# EAGLE design MoonInMyRoom (EAGLE 5.10)
EAGLEUP: TQFP32
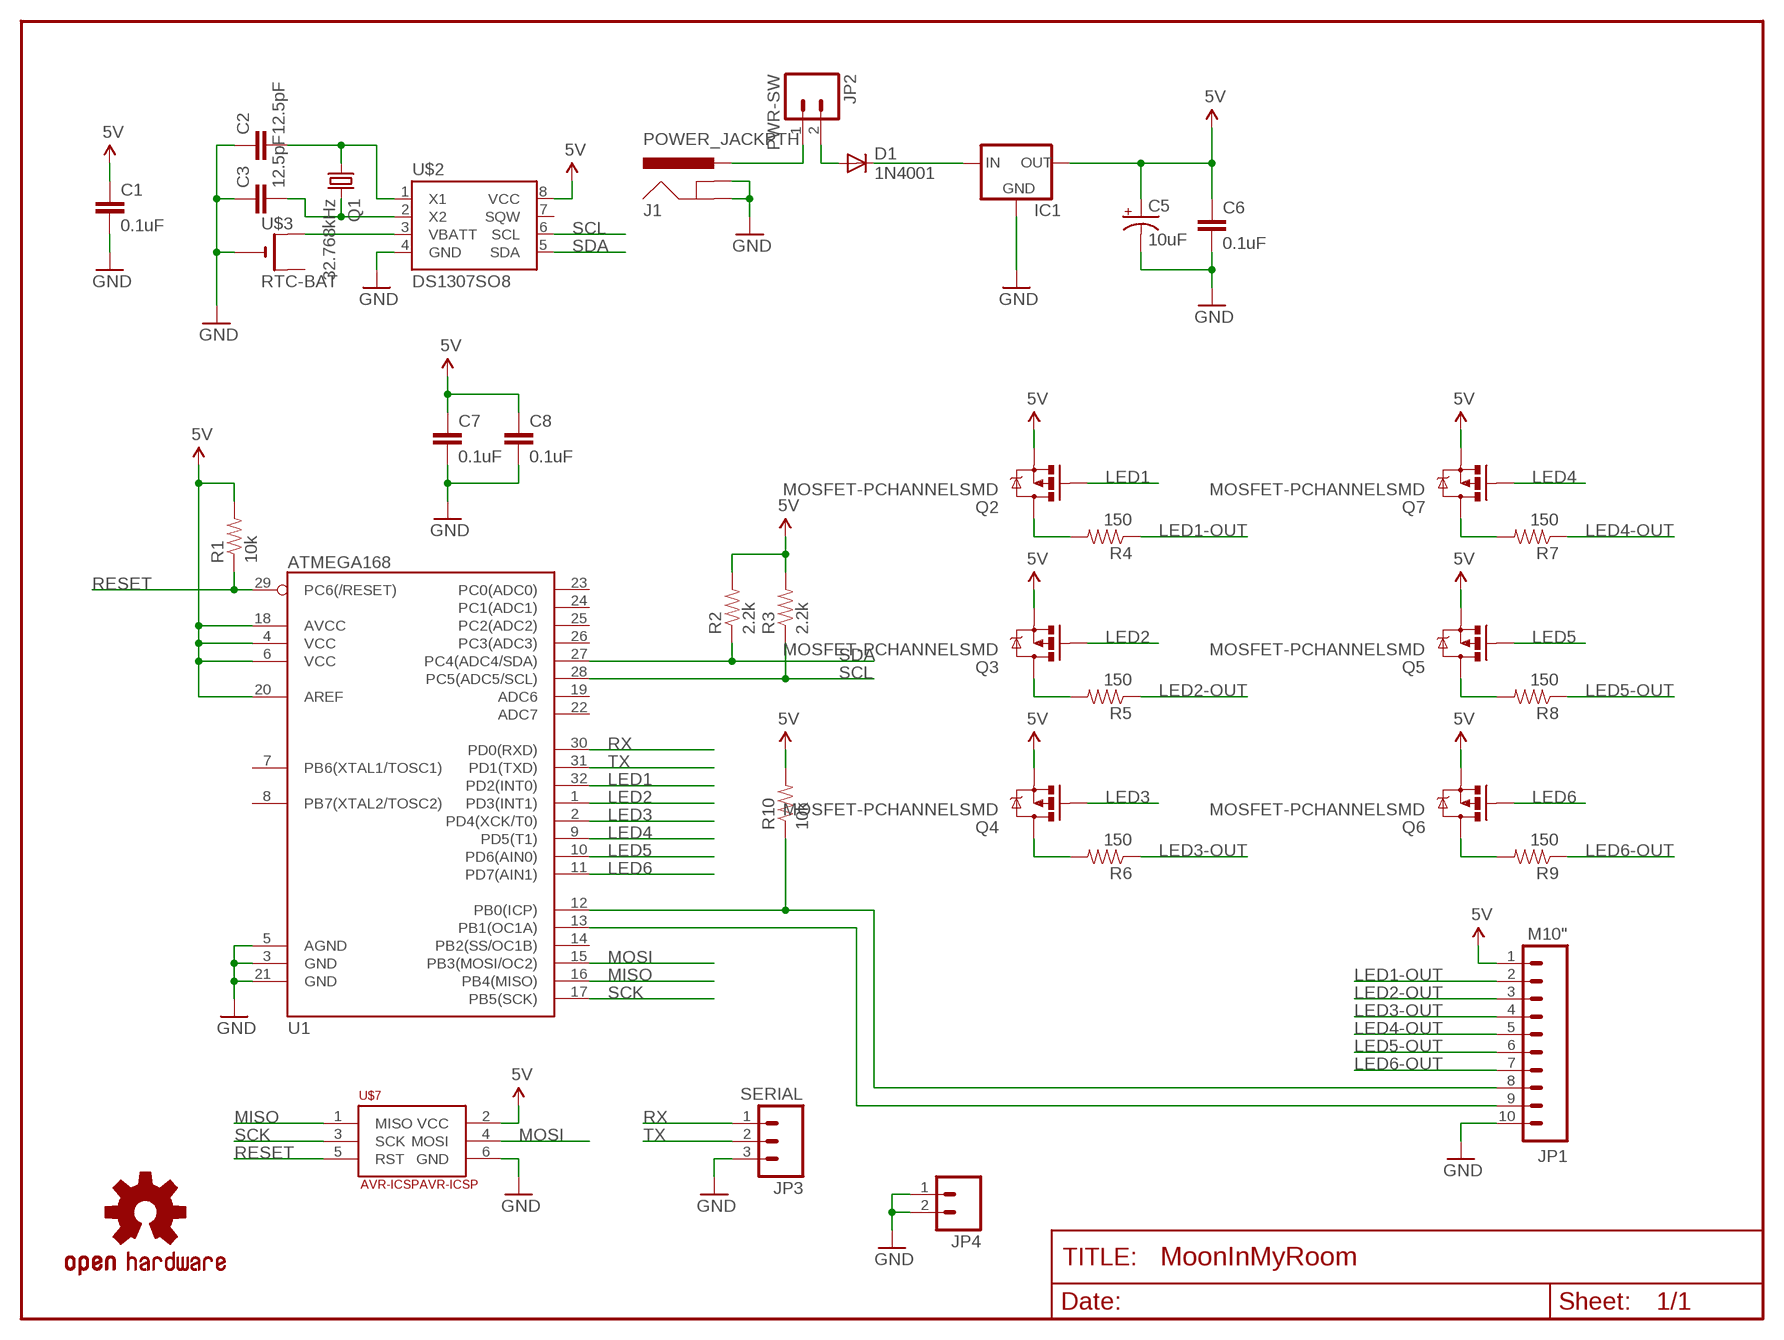
[diagram p0: schematic, sheet 1]

## Parts
C1  0.1uF  CAP0805  [0805]
C2  12.5pF  CAP0805  [0805]
C3  12.5pF  CAP0805  [0805]
C5  10uF  CAP_POL1206  [EIA3216]
C6  0.1uF  CAP0805  [0805]
C7  0.1uF  CAP0805  [0805]
C8  0.1uF  CAP0805  [0805]
D1  1N4001  DIODESMA  [SMA-DIODE]
IC1  V_REG_78XXSINK  [TO220-IGO]
J1  POWER_JACKPTH  [POWER_JACK_PTH]
JP1  M10"  [1X10]
JP2  PWR-SW  M02PTH  [1X02]
JP3  SERIAL  M03PTH  [1X03]
JP4  M02PTH  [1X02]
Q1  32.768kHz  CRYSTALSOJ-4-5.5MM  [SOJ-4-5.5MM]
Q2  MOSFET-PCHANNELSMD  [SOT23-3]
Q3  MOSFET-PCHANNELSMD  [SOT23-3]
Q4  MOSFET-PCHANNELSMD  [SOT23-3]
Q5  MOSFET-PCHANNELSMD  [SOT23-3]
Q6  MOSFET-PCHANNELSMD  [SOT23-3]
Q7  MOSFET-PCHANNELSMD  [SOT23-3]
R1  10k  RESISTOR0805-RES  [0805]
R2  2.2k  RESISTOR0805-RES  [0805]
R3  2.2k  RESISTOR0805-RES  [0805]
R4  150  RESISTOR0805-RES  [0805]
R5  150  RESISTOR0805-RES  [0805]
R6  150  RESISTOR0805-RES  [0805]
R7  150  RESISTOR0805-RES  [0805]
R8  150  RESISTOR0805-RES  [0805]
R9  150  RESISTOR0805-RES  [0805]
R10  10k  RESISTOR0805-RES  [0805]
U1  ATMEGA168  [TQFP32-08]
U$2  DS1307SO8  [SO08]
U$3  RTC-BAT  CR1220SMT  [CR1220-SMD]
U$7  AVR-ICSPAVR-ICSP  [AVR-ICSP]
U$20  OSHW-LOGOM  [OSHW-LOGO-M]

## Nets
5V: C1.1 C5.A(+) C6.1 C7.1 C8.1 IC1.OUT JP1.1 Q2.2(S) Q3.2(S) Q4.2(S) Q5.2(S) Q6.2(S) Q7.2(S) R1.2 R2.2 R3.2 R10.2 U1.4(VCC) U1.6(VCC) U1.18(AVCC) U1.20(AREF) U$2.8(VCC) U$7.2(VCC)
GND: C1.2 C2.1 C3.1 C5.C(-) C6.2 C7.2 C8.2 IC1.GND J1.GND J1.GNDBREAK JP1.10 JP3.3 JP4.1 JP4.2 U1.3(GND) U1.5(AGND) U1.21(GND) U$2.4(GND) U$3.- U$7.6(GND)
LED1: Q2.1(G) U1.32(PD2(INT0))
LED1-OUT: JP1.2 R4.1
LED2: Q3.1(G) U1.1(PD3(INT1))
LED2-OUT: JP1.3 R5.1
LED3: Q4.1(G) U1.2(PD4(XCK/T0))
LED3-OUT: JP1.4 R6.1
LED4: Q7.1(G) U1.9(PD5(T1))
LED4-OUT: JP1.5 R7.1
LED5: Q5.1(G) U1.10(PD6(AIN0))
LED5-OUT: JP1.6 R8.1
LED6: Q6.1(G) U1.11(PD7(AIN1))
LED6-OUT: JP1.7 R9.1
MISO: U1.16(PB4(MISO)) U$7.1(MISO)
MOSI: U1.15(PB3(MOSI/OC2)) U$7.4(MOSI)
N$1: U$2.3(VBATT) U$3.+$1(+)
N$2: Q2.3(D) R4.2
N$3: C3.2 Q1.P4 U$2.2(X2)
N$4: C2.2 Q1.P1 U$2.1(X1)
N$5: JP1.8 R10.1 U1.12(PB0(ICP))
N$6: Q3.3(D) R5.2
N$7: Q4.3(D) R6.2
N$8: Q5.3(D) R8.2
N$9: Q6.3(D) R9.2
N$10: JP1.9 U1.13(PB1(OC1A))
N$11: J1.PWR JP2.1
N$12: D1.A JP2.2
N$13: D1.C IC1.IN
N$16: Q7.3(D) R7.2
RESET: R1.1 U1.29(PC6(/RESET)) U$7.5(RST)
RX: JP3.1 U1.30(PD0(RXD))
SCK: U1.17(PB5(SCK)) U$7.3(SCK)
SCL: R3.1 U1.28(PC5(ADC5/SCL)) U$2.6(SCL)
SDA: R2.1 U1.27(PC4(ADC4/SDA)) U$2.5(SDA)
TX: JP3.2 U1.31(PD1(TXD))
Unconnected: U1.7(PB6(XTAL1/TOSC1)) U1.8(PB7(XTAL2/TOSC2)) U1.14(PB2(SS/OC1B)) U1.19(ADC6) U1.22(ADC7) U1.23(PC0(ADC0)) U1.24(PC1(ADC1)) U1.25(PC2(ADC2)) U1.26(PC3(ADC3)) U$2.7(SQW) U$3.+$2(+1)

## Library data of the parts
C1-C3 C6-C8 = SparkFun:CAP: Capacitor Standard 0603 ceramic capacitor, and 0.1" leaded capacitor.
C5 = SparkFun:CAP_POL: Capacitor Polarized These are standard SMD and PTH capacitors. Normally 10uF, 47uF, and 100uF in electrolytic and tantalum varieties. Always verify the external diameter of the through hole cap, it varies with capacity, voltage, and manufacturer. The EIA devices should be standard.
D1 = SparkFun:DIODE: Diode These are standard reverse protection diodes and small signal diodes. SMA package can handle up to about 1A. SOD-323 can handle about 200mA. What the SOD-323 package when ordering, there are some mfgs out there that are 5-pin packages.
IC1 = SparkFun:V_REG_78XX: Voltage Regulator Standard 7805 5V regulator. IGO (Input Ground Output). Spark Fun Electronics SKU : COM-00107
J1 = SparkFun:POWER_JACK: Power Jack This is the standard 5.5mm barrel jack for power. The PTH is the most common, proven, reliable, footprint. All others are experimental. The Slot footprint only works if the mill layer is transmitted to the PCB fab house so be warned. Spark Fun Electronics SKU : PRT-00119. Mating wall wart : TOL-00298 (and others)
JP1 = SparkFun:M10: Header 10 Standard 10-pin 0.1" header. Use with straight break away headers (SKU : PRT-00116), right angle break away headers (PRT-00553), swiss pins (PRT-00743), machine pins (PRT-00117), and female headers (PRT-00115).
JP2 JP4 = SparkFun:M02: Header 2 Standard 2-pin 0.1" header. Use with straight break away headers (SKU : PRT-00116), right angle break away headers (PRT-00553), swiss pins (PRT-00743), machine pins (PRT-00117), and female headers (PRT-00115). Molex polarized connector foot print use with SKU : PRT-08233 with associated crimp pins and housings.
JP3 = SparkFun:M03: Header 3 Standard 3-pin 0.1" header. Use with straight break away headers (SKU : PRT-00116), right angle break away headers (PRT-00553), swiss pins (PRT-00743), machine pins (PRT-00117), and female headers (PRT-00115). Molex polarized connector foot print use with SKU : PRT-08232 with associated crimp pins and housings.
Q1 = FiveVolt:CRYSTAL
Q2-Q7 = SparkFun:MOSFET-PCHANNEL
R1-R10 = SparkFun:RESISTOR: Resistor Basic schematic elements and footprints for 0603, 1206, and PTH resistors.
U1 = SparkFun:ATMEGA168
U$2 = SparkFun:DS1307
U$3 = adafruit:CR1220: CR1216/CR1220/CR1225 12mm 3V lithium coin cell Great for battery packup. Both SMT and THM holders. Note the THM package has the ground pads on both sides of the PCB so that the masks are the same - this reduces the cost
U$7 = FiveVolt:AVR-ICSP; EAGLEUP: JP3Q
U$20 = SparkFun:OSHW-LOGO: Open Source Hardware Logo This logo indicates the piece of hardware it is found on incorporates a OSHW license and/or adheres to the definition of open source hardware found here: http://freedomdefined.org/OSHW

## Board
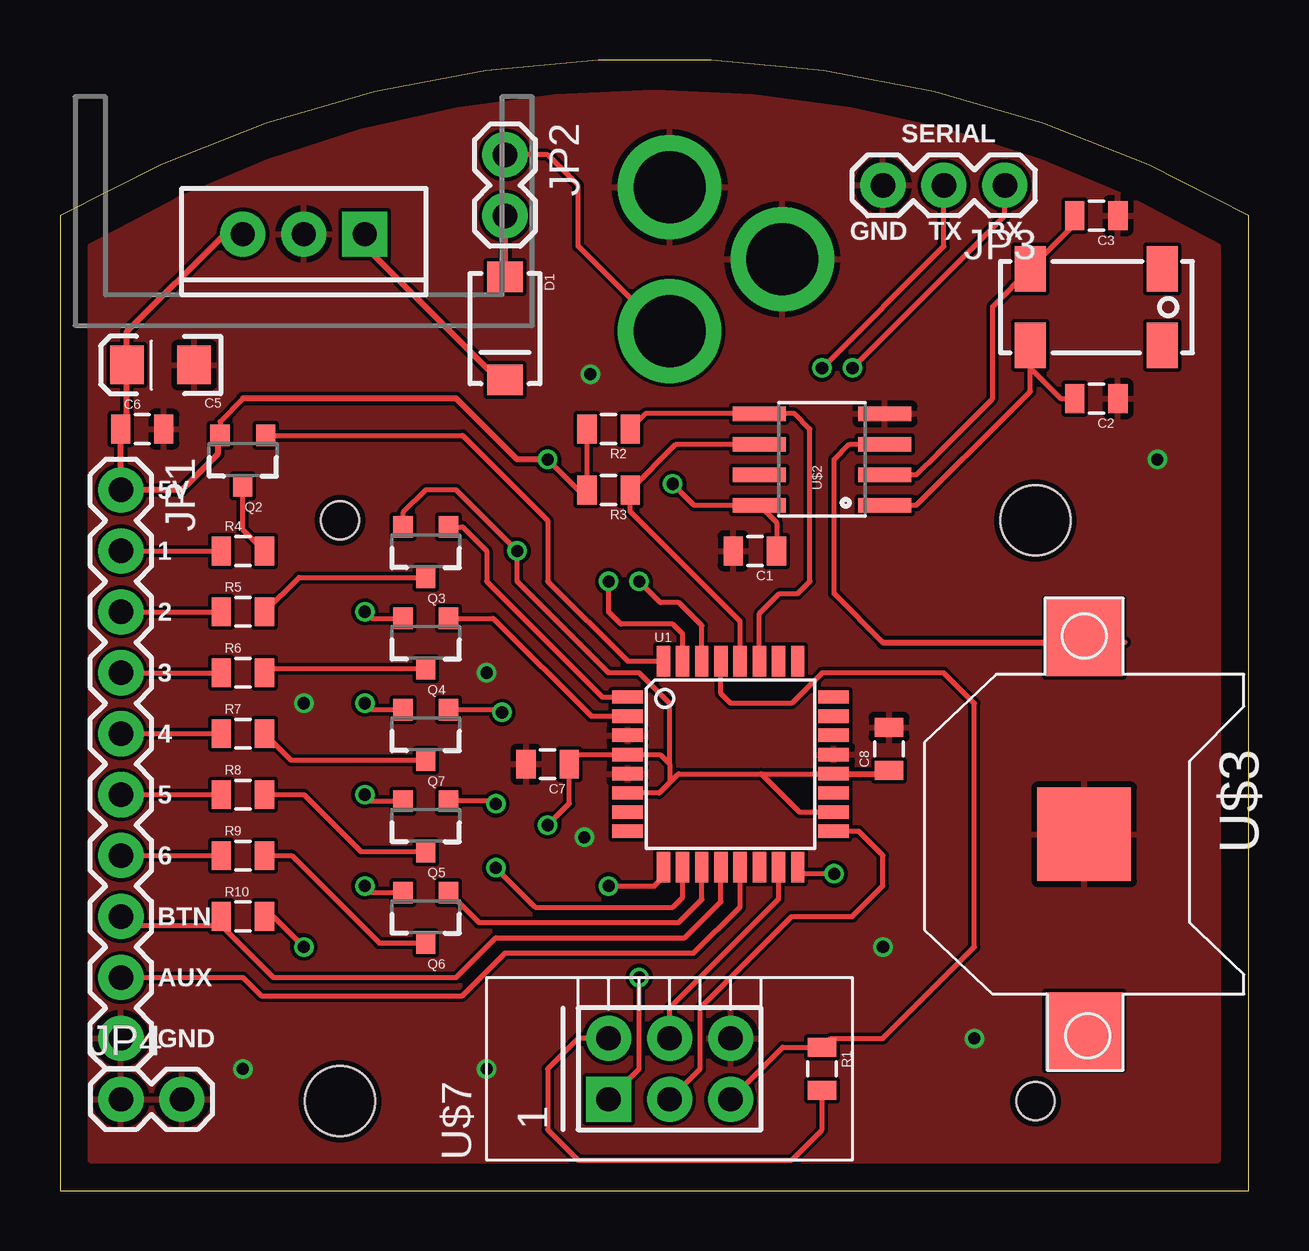
[diagram p1: board, top side]
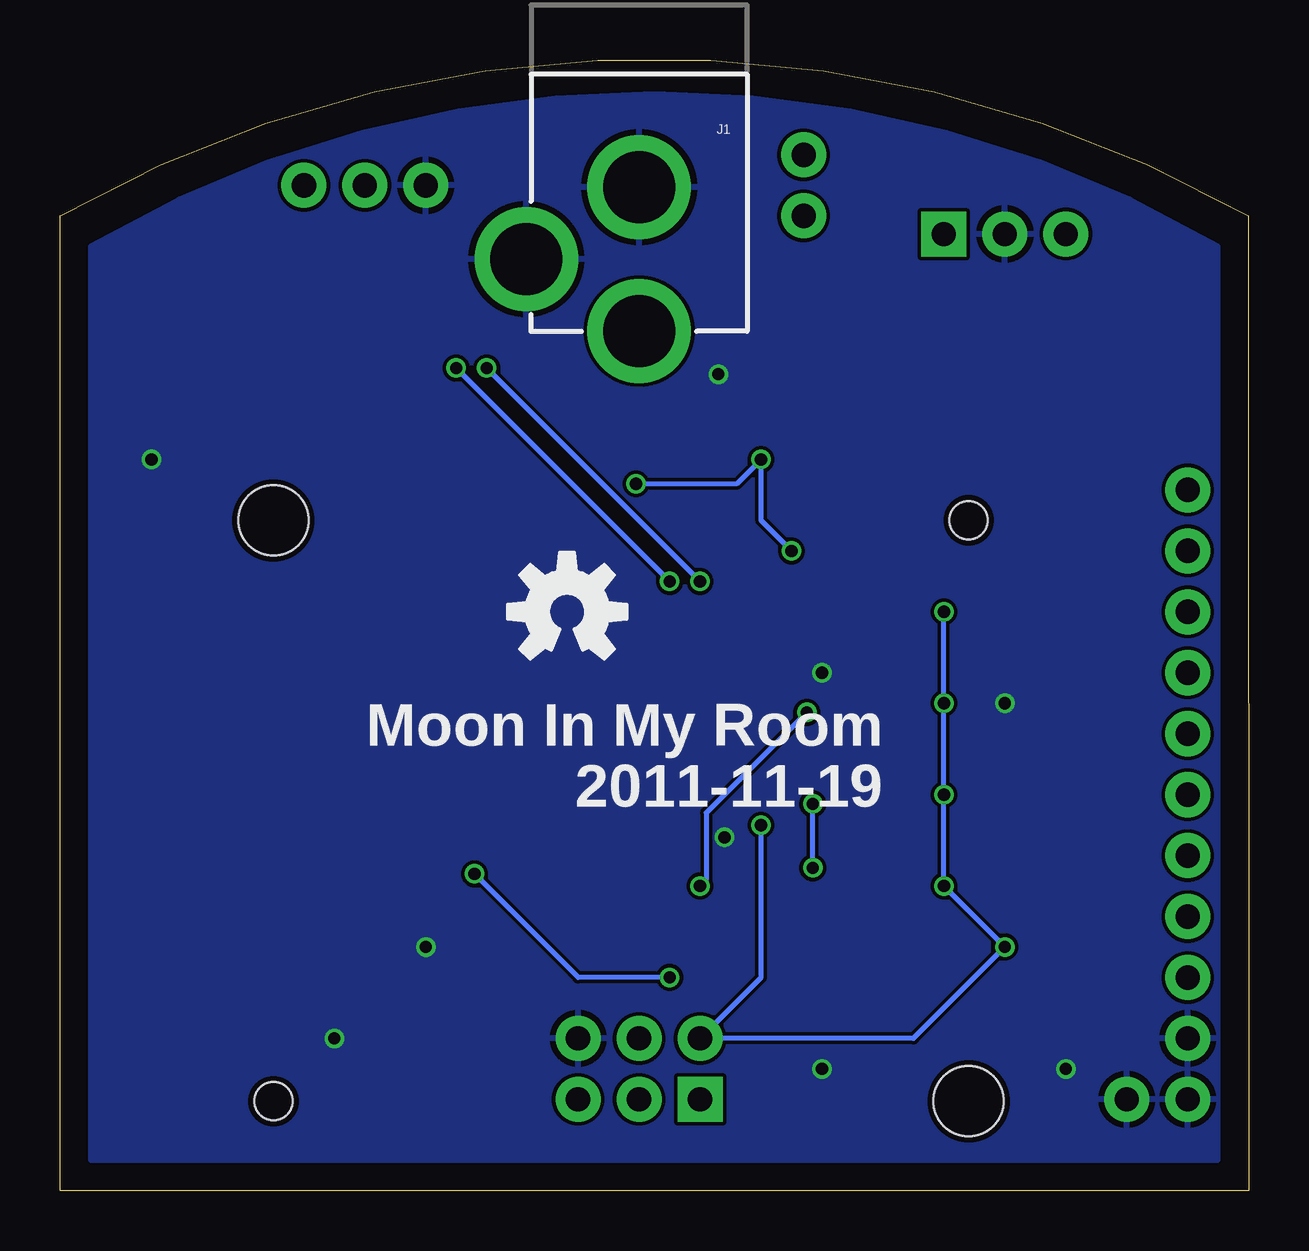
[diagram p2: board, bottom side, seen from below]

Size 49.53 x 47.13 mm. Coordinates in mm from the lower left corner, seen from the top.
Outline: 49.53,40.64 arc59 0.02,40.64 0,0 49.53,0 49.53,40.64
Copper layers (1*16): Top 0.035mm / dielectric 1.5mm / Bottom 0.035mm
Design rules "ITead_rule": minimum track width 6mil, minimum drill 12mil, track to track 6mil, track to pad 6mil, pad to pad 6mil, via to via 6mil, smd to smd 0mil, copper to edge 10mil, drill to drill 10mil, minimum pad ring 10mil, minimum via ring 6mil, stop-mask expansion 2mil, vias tented up to drill 100mil, thermal gap 10mil
Holes 2.92 mm at 40.64,27.94 11.67,3.73
Holes 1.59 mm at 11.67,27.94 40.64,3.73

### Footprints (pad centres in the part's own frame; a part is rotated, then mirrored left to right if it is on the bottom)
0805 = smd 0.8 x 1.2: 1 -0.9,0; 2 0.9,0
EIA3216 = smd 1.4 x 1.6: A 1.4,0; C -1.4,0
SMA-DIODE = smd 1.27 x 1.47: A -2.15,0; C 2.15,0
TO220-IGO = drill 1 pad 1.88 round: GND 0,0; OUT 2.54,0 | drill 1 pad 1.88 square: IN -2.54,0
POWER_JACK_PTH = drill 2.997 pad 4.318 round: GND 0,7.7; GNDBREAK 4.7,10.7; PWR 0,13.7
1X10 = drill 1.016 pad 1.88 round: 1 0,0; 2 2.54,0; 3 5.08,0; 4 7.62,0; 5 10.16,0; 6 12.7,0; 7 15.24,0; 8 17.78,0; 9 20.32,0; 10 22.86,0
1X02 = drill 1.016 pad 1.88 round: 1 0,0; 2 2.54,0
1X03 = drill 1.016 pad 1.88 round: 1 0,0; 2 2.54,0; 3 5.08,0
SOJ-4-5.5MM = smd 1.3 x 1.9: P1 -2.75,-1.6; P2 2.75,-1.6; P3 2.75,1.6; P4 -2.75,1.6
SOT23-3 = smd 0.8 x 0.9: 1 -0.95,-1; 2 0.95,-1; 3 0,1.1
TQFP32-08 = smd 1.27 x 0.559: 1 -4.293,2.8; 2 -4.293,2; 3 -4.293,1.2; 4 -4.293,0.4; 5 -4.293,-0.4; 6 -4.293,-1.2; 7 -4.293,-2; 8 -4.293,-2.8; 17 4.293,-2.8; 18 4.293,-2; 19 4.293,-1.2; 20 4.293,-0.4; 21 4.293,0.4; 22 4.293,1.2; 23 4.293,2; 24 4.293,2.8 | smd 0.559 x 1.27: 9 -2.8,-4.293; 10 -2,-4.293; 11 -1.2,-4.293; 12 -0.4,-4.293; 13 0.4,-4.293; 14 1.2,-4.293; 15 2,-4.293; 16 2.8,-4.293; 25 2.8,4.293; 26 2,4.293; 27 1.2,4.293; 28 0.4,4.293; 29 -0.4,4.293; 30 -1.2,4.293; 31 -2,4.293; 32 -2.8,4.293
SO08 = smd 0.61 x 2.21: 1 -1.905,-2.616; 2 -0.635,-2.616; 3 0.635,-2.616; 4 1.905,-2.616; 5 1.905,2.616; 6 0.635,2.616; 7 -0.635,2.616; 8 -1.905,2.616
CR1220-SMD = smd 3.2 x 3.2: +$1 -8.2,0; +$2 8.2,0 | smd 3.9 x 3.9: - 0,0
AVR-ICSP = drill 1.016 pad 1.88 square: 1 -1.27,2.54 | drill 1.016 pad 1.88 round: 2 1.27,2.54; 3 -1.27,0; 4 1.27,0; 5 -1.27,-2.54; 6 1.27,-2.54

### Placement (x,y rotation side)
C1  28.96,26.67 180 top
C2  43.18,33.02 180 top
C3  43.18,40.64 180 top
C5  4.19,34.42 180 top
C6  3.43,31.75 0 top
C7  20.32,17.78 180 top
C8  34.54,18.41 90 top
D1  18.54,35.94 270 top
IC1  10.16,39.88 180 top
J1  25.4,49.53 180 bottom
JP1  2.54,29.21 270 top
JP2  18.54,43.18 270 top
JP3  39.37,41.91 180 top
JP4  2.54,3.81 0 top
Q1  43.18,36.83 0 top
Q2  7.62,30.48 180 top
Q3  15.24,26.67 180 top
Q4  15.24,22.86 180 top
Q5  15.24,15.24 180 top
Q6  15.24,11.43 180 top
Q7  15.24,19.05 180 top
R1  31.75,5.08 270 top
R2  22.86,31.75 180 top
R3  22.86,29.21 180 top
R4  7.62,26.67 0 top
R5  7.62,24.13 0 top
R6  7.62,21.59 0 top
R7  7.62,19.05 0 top
R8  7.62,16.51 0 top
R9  7.62,13.97 0 top
R10  7.62,11.43 0 top
U1  27.94,17.78 0 top
U$2  31.75,30.48 90 top
U$3  42.67,14.86 270 top
U$7  25.4,5.08 90 top
U$20  28.4,24.13 0 bottom

### Tracks (layer width: path | path; a pad name or v marks a point on that pad's centre or on a via)
5V  (via drill 0.51)
  Top 0.203: 25.4,17.78 25,18.18 U1.4 21.62,18.18 C7.1 21.22,16.14 v20.32,15.24 | U1.6 24.96,16.58 25.4,17.02 | 25.4,17.78 25.4,17.02 | 29.21,17.38 25.76,17.38 25.4,17.02 | 29.21,17.38 U1.20 | U1.18 30.81,15.78 29.21,17.38 | R2.2 R3.2 21.59,29.21 v20.32,30.48 | C1.1 29.86,27.85 U$2.8 26.42,28.57 v25.53,29.46 | U$7.2 21.59,6.35 20.32,5.08 20.32,2.54 21.59,1.27 30.48,1.27 31.75,2.54 R1.2 | 6.57,31.58 Q2.2 6.67,32.07 7.62,33.02 | 25.4,17.78 25.4,20.32 24.13,21.59 22.86,21.59 19.05,25.4 v19.05,26.67 16.51,29.21 15.24,29.21 14.29,28.26 Q3.2 | R10.2 8.89,11.43 v10.16,10.16 | Q6.2 12.97,12.43 v12.7,12.7 | Q5.2 12.97,16.24 v12.7,16.51 | Q7.2 12.97,20.05 v12.7,20.32 | Q4.2 12.97,23.86 v12.7,24.13
  Top 0.254: U1.20 34.41,17.38 C8.1 | 7.62,33.02 16.51,33.02 19.05,30.48 v20.32,30.48 | 6.57,31.58 6.57,30.7 5.08,29.21 JP1.1 2.53,29.22 C6.1 2.79,32.01 C5.A 2.79,35.81 6.86,39.88 IC1.OUT
  Bottom 0.203: v25.53,29.46 21.34,29.46 v20.32,30.48 20.32,27.94 v19.05,26.67 | v20.32,15.24 20.32,8.89 U$7.2 13.97,6.35 v10.16,10.16 v12.7,12.7 v12.7,16.51 v12.7,20.32 v12.7,24.13
GND  (via drill 0.51)
  other vias: 22.1,34.04 7.62,5.08 17.78,21.59 10.16,20.32 17.78,5.08 34.29,10.16 38.1,6.35 45.72,30.48 21.84,14.73
  pour Top: 48.26,1.27 48.26,39.37 arc61 1.27,39.37 1.27,1.27
  pour Bottom: 1.27,1.27 1.27,39.37 arc-61 48.26,39.37 48.26,1.27
LED1
  Top 0.203: U1.32 23.65,22.07 20.32,25.4 20.32,27.94 16.78,31.48 Q2.1
LED1-OUT
  Top 0.203: JP1.2 R4.1
LED2
  Top 0.203: Q3.1 16.78,27.67 17.78,26.67 17.78,25.4 22.6,20.58 U1.1
LED2-OUT
  Top 0.203: JP1.3 R5.1
LED3
  Top 0.203: U1.2 22.13,19.78 18.05,23.86 Q4.1
LED3-OUT
  Top 0.203: JP1.4 R6.1
LED4  (via drill 0.51)
  Top 0.203: Q7.1 18.3,20.05 v18.41,19.94 | U1.9 25.14,13.07 24.77,12.7 v22.86,12.7
  Bottom 0.203: v18.41,19.94 22.61,15.75 22.61,12.95 v22.86,12.7
LED4-OUT
  Top 0.203: JP1.5 R7.1
LED5  (via drill 0.51)
  Top 0.203: Q5.1 18.05,16.24 v18.16,16.13 | U1.10 25.94,12.22 25.53,11.81 19.81,11.81 v18.16,13.46
  Bottom 0.203: v18.16,13.46 v18.16,16.13
LED5-OUT
  Top 0.203: JP1.6 R8.1
LED6
  Top 0.203: U1.11 26.74,12.13 25.78,11.18 17.44,11.18 Q6.1
LED6-OUT
  Top 0.203: JP1.7 R9.1
MISO  (via drill 0.51)
  Top 0.203: U$7.1 24.13,5.08 v24.13,8.89 | v32.26,13.21 31.02,13.21 U1.16
  Bottom 0.203: v24.13,8.89 27.94,8.89 v32.26,13.21
MOSI
  Top 0.203: U$7.4 25.4,7.62 29.94,12.16 U1.15
N$1
  Top 0.203: U$2.3 32.89,31.11 32.26,30.48 32.26,24.89 34.29,22.86 | U$3.+$1 44.38,22.86
  Top 0.254: 34.29,22.86 42.47,22.86 U$3.+$1
N$2
  Top 0.203: Q2.3 7.62,27.57 R4.2
N$3
  Top 0.203: U$2.2 35.69,29.84 36.58,30.73 38.86,33.02 38.86,36.86 Q1.P4 42.28,40.28
  Top 0.254: 42.28,40.28 C3.2
N$4
  Top 0.203: U$2.1 35.69,28.57 39.7,32.59 40.43,33.32 40.43,34.29 41.7,33.02 C2.2
  Top 0.254: 40.43,34.29 Q1.P1
N$5
  Top 0.203: 6.72,11.06 R10.1 | 6.72,11.06 8.89,8.89 16.51,8.89 18.16,10.54 26.04,10.54 27.54,12.05 U1.12 | 6.72,11.06 2.91,11.06 JP1.8
N$6
  Top 0.203: Q3.3 9.96,25.57 R5.2
N$7
  Top 0.203: Q4.3 8.69,21.76 R6.2
N$8
  Top 0.203: 8.79,16.24 R8.2 10.16,16.51 12.53,14.14 Q5.3
N$9
  Top 0.203: Q6.3 13.29,10.33 9.65,13.97 R9.2
N$10
  Top 0.203: JP1.9 7.62,8.89 8.38,8.13 16.76,8.13 18.54,9.91 26.42,9.91 28.34,11.83 U1.13
N$11
  Top 0.203: J1.PWR 25.13,35.83 21.59,39.37 21.59,41.91 20.32,43.18 JP2.1
N$12
  Top 0.254: D1.A JP2.2
N$13
  Top 0.254: D1.C 18.28,33.79 12.7,39.37 IC1.IN
N$16
  Top 0.203: Q7.3 9.62,17.95 R7.2
RESET
  Top 0.203: U$7.5 30.11,5.98 R1.1 32.12,6.35 34.29,6.35 38.1,10.16 38.1,20.32 36.83,21.59 31.75,21.59 30.48,20.32 27.94,20.32 27.54,20.72 U1.29
RX  (via drill 0.51)
  Top 0.203: JP3.1 39.37,40.64 v33.02,34.29 | U1.30 26.74,23.55 25.78,24.51 25.02,24.51 v24.13,25.4
  Bottom 0.203: v24.13,25.4 v33.02,34.29
SCK
  Top 0.203: U$7.3 26.67,5.08 26.67,7.62 30.48,11.43 33.02,11.43 34.29,12.7 34.29,13.97 33.28,14.98 U1.17
SCL
  Top 0.203: U$2.6 25.66,31.11 R3.1 23.76,28.31 28.34,23.73 U1.28
SDA
  Top 0.203: R2.1 24.39,32.38 U$2.5 30.61,32.38 31.24,31.75 31.24,25.4 30.73,24.89 29.97,24.89 29.14,24.06 U1.27
TX  (via drill 0.51)
  Top 0.203: JP3.2 36.83,39.37 v31.75,34.29 | U1.31 25.94,23.21 25.53,23.62 23.37,23.62 22.86,24.13 v22.86,25.4
  Bottom 0.203: v22.86,25.4 v31.75,34.29

### Text on the board
tPlace: SERIAL | GND | TX | RX | 5V | 1 | 2 | 3 | 4 | 5 | 6 | BTN | AUX | GND
bPlace: Moon In My Room | 2011-11-19